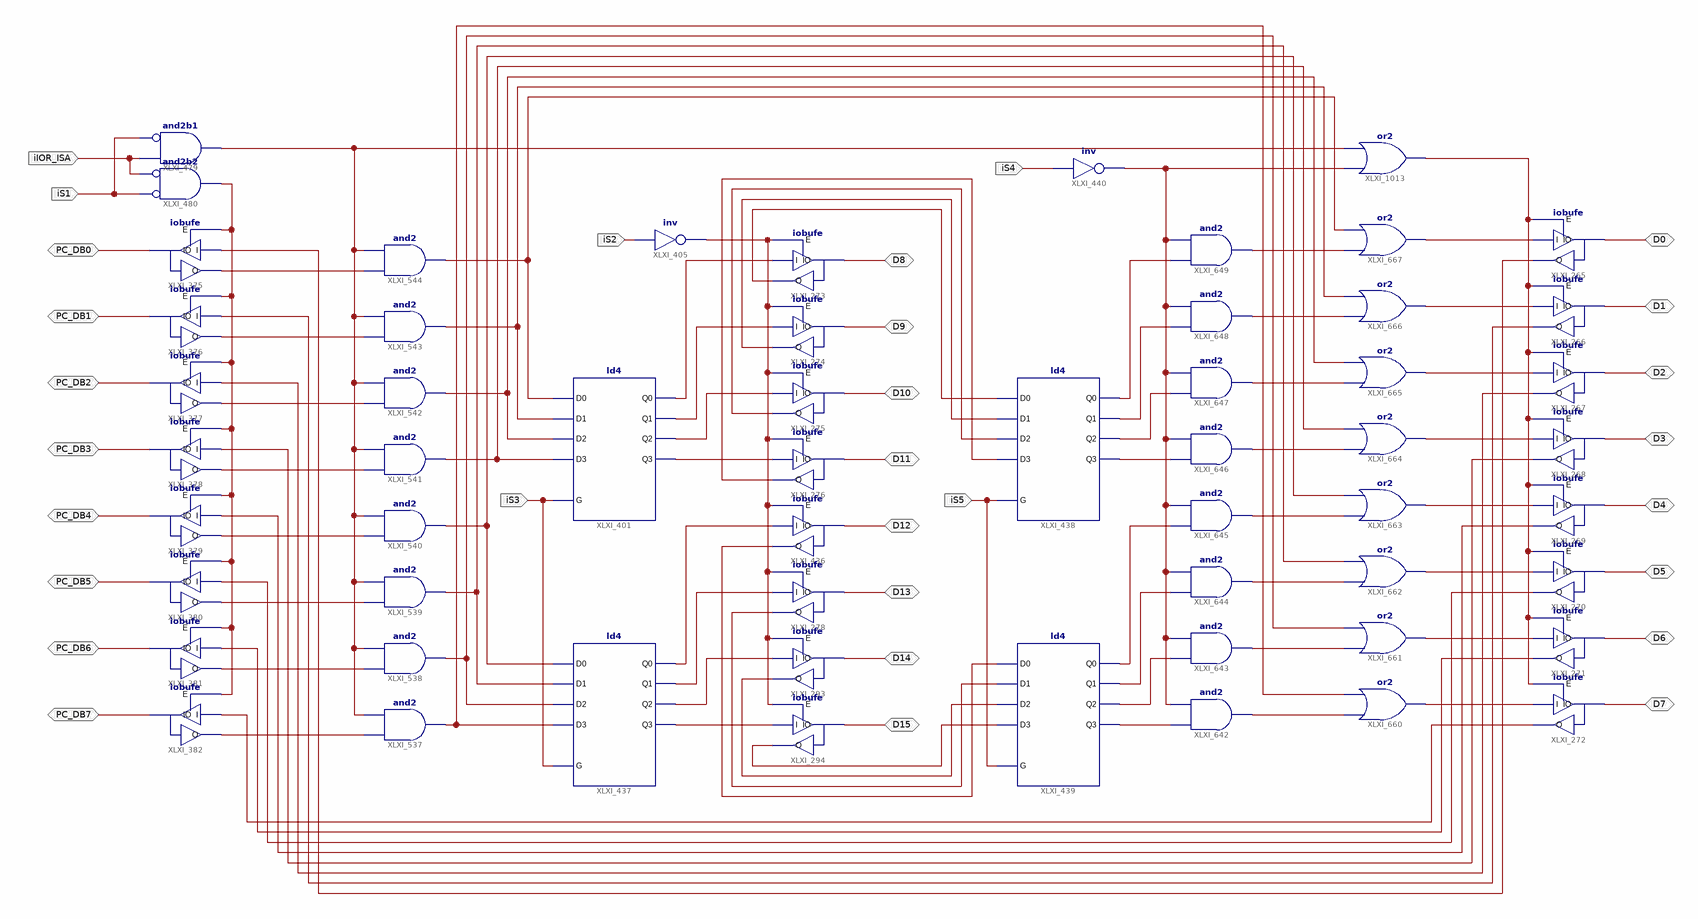
[diagram p0: schematic sheet 1]
// Xilinx ISE schematic IDE_MUX_8bit_16bit.sch (xc9500xl) as structural Verilog: 57 symbols, 30 ports
module IDE_MUX_8bit_16bit (
  input  iS3,
  input  iS2,
  input  iS4,
  input  iS5,
  input  iS1,
  input  iIOR_ISA,
  inout  D12,
  inout  D13,
  inout  D14,
  inout  D15,
  inout  D8,
  inout  D9,
  inout  D10,
  inout  D11,
  inout  PC_DB5,
  inout  PC_DB6,
  inout  PC_DB7,
  inout  PC_DB4,
  inout  PC_DB3,
  inout  PC_DB2,
  inout  PC_DB1,
  inout  PC_DB0,
  inout  D7,
  inout  D6,
  inout  D5,
  inout  D4,
  inout  D3,
  inout  D2,
  inout  D1,
  inout  D0
);

  wire XLXN_50, XLXN_130, XLXN_159, XLXN_160, XLXN_161, XLXN_168, XLXN_169, XLXN_177, XLXN_199, XLXN_200,
       XLXN_201, XLXN_211, XLXN_212, XLXN_213, XLXN_214, XLXN_285, XLXN_289, XLXN_290, XLXN_563, XLXN_564,
       XLXN_565, XLXN_576, XLXN_577, XLXN_578, XLXN_579, XLXN_584, XLXN_594, XLXN_727, XLXN_734, XLXN_738,
       XLXN_742, XLXN_743, XLXN_744, XLXN_745, XLXN_773, XLXN_774, XLXN_775, XLXN_776, XLXN_777, XLXN_778,
       XLXN_779, XLXN_780, XLXN_781, XLXN_782, XLXN_783, XLXN_784, XLXN_785, XLXN_786, XLXN_787, XLXN_1089,
       XLXN_1090, XLXN_1092, XLXN_1093, XLXN_1102, XLXN_1110, XLXN_1111, XLXN_1112, XLXN_1247, XLXN_1249,
       XLXN_1283, XLXN_1407, XLXN_1414, XLXN_1415, XLXN_1416, XLXN_1417, XLXN_1418, XLXN_1419, XLXN_1420,
       XLXN_1421;

  and XLXI_537 (XLXN_1247, XLXN_289, XLXN_1283);
  and XLXI_538 (XLXN_564, XLXN_563, XLXN_1283);
  and XLXI_539 (XLXN_565, XLXN_285, XLXN_1283);
  and XLXI_540 (XLXN_1093, XLXN_290, XLXN_1283);
  and XLXI_541 (XLXN_1092, XLXN_579, XLXN_1283);
  and XLXI_542 (XLXN_1090, XLXN_578, XLXN_1283);
  and XLXI_543 (XLXN_1089, XLXN_577, XLXN_1283);
  and XLXI_544 (XLXN_594, XLXN_576, XLXN_1283);
  ld4 XLXI_401 (
    .D0(XLXN_594), .D1(XLXN_1089), .D2(XLXN_1090), .D3(XLXN_1092), .G(iS3), .Q0(XLXN_159), .Q1(XLXN_160),
    .Q2(XLXN_161), .Q3(XLXN_50));
  ld4 XLXI_437 (
    .D0(XLXN_1093), .D1(XLXN_565), .D2(XLXN_564), .D3(XLXN_1247), .G(iS3), .Q0(XLXN_177), .Q1(XLXN_168),
    .Q2(XLXN_169), .Q3(XLXN_130));
  iobufe XLXI_278 (.I(XLXN_168), .IO(D13), .O(XLXN_201), .E(XLXN_734));
  iobufe XLXI_293 (.I(XLXN_169), .IO(D14), .O(XLXN_200), .E(XLXN_734));
  iobufe XLXI_294 (.I(XLXN_130), .IO(D15), .O(XLXN_199), .E(XLXN_734));
  iobufe XLXI_436 (.I(XLXN_177), .IO(D12), .O(XLXN_727), .E(XLXN_734));
  iobufe XLXI_273 (.I(XLXN_159), .IO(D8), .O(XLXN_214), .E(XLXN_734));
  iobufe XLXI_274 (.I(XLXN_160), .IO(D9), .O(XLXN_213), .E(XLXN_734));
  iobufe XLXI_275 (.I(XLXN_161), .IO(D10), .O(XLXN_212), .E(XLXN_734));
  iobufe XLXI_276 (.I(XLXN_50), .IO(D11), .O(XLXN_211), .E(XLXN_734));
  and XLXI_642 (XLXN_773, XLXN_738, XLXN_1102);
  and XLXI_643 (XLXN_776, XLXN_1110, XLXN_1102);
  and XLXI_644 (XLXN_777, XLXN_1111, XLXN_1102);
  and XLXI_645 (XLXN_782, XLXN_1112, XLXN_1102);
  and XLXI_646 (XLXN_781, XLXN_742, XLXN_1102);
  and XLXI_647 (XLXN_783, XLXN_743, XLXN_1102);
  and XLXI_648 (XLXN_785, XLXN_744, XLXN_1102);
  and XLXI_649 (XLXN_1249, XLXN_745, XLXN_1102);
  not XLXI_440 (XLXN_1102, iS4);
  not XLXI_405 (XLXN_734, iS2);
  ld4 XLXI_439 (
    .D0(XLXN_727), .D1(XLXN_201), .D2(XLXN_200), .D3(XLXN_199), .G(iS5), .Q0(XLXN_1112), .Q1(XLXN_1111),
    .Q2(XLXN_1110), .Q3(XLXN_738));
  ld4 XLXI_438 (
    .D0(XLXN_214), .D1(XLXN_213), .D2(XLXN_212), .D3(XLXN_211), .G(iS5), .Q0(XLXN_745), .Q1(XLXN_744),
    .Q2(XLXN_743), .Q3(XLXN_742));
  or XLXI_667 (XLXN_787, XLXN_1249, XLXN_594);
  or XLXI_666 (XLXN_786, XLXN_785, XLXN_1089);
  or XLXI_665 (XLXN_784, XLXN_783, XLXN_1090);
  or XLXI_664 (XLXN_780, XLXN_781, XLXN_1092);
  or XLXI_663 (XLXN_779, XLXN_782, XLXN_1093);
  or XLXI_662 (XLXN_778, XLXN_777, XLXN_565);
  or XLXI_661 (XLXN_775, XLXN_776, XLXN_564);
  or XLXI_660 (XLXN_774, XLXN_773, XLXN_1247);
  iobufe XLXI_375 (.I(XLXN_1421), .IO(PC_DB0), .O(XLXN_576), .E(XLXN_584));
  iobufe XLXI_376 (.I(XLXN_1420), .IO(PC_DB1), .O(XLXN_577), .E(XLXN_584));
  iobufe XLXI_377 (.I(XLXN_1419), .IO(PC_DB2), .O(XLXN_578), .E(XLXN_584));
  iobufe XLXI_378 (.I(XLXN_1418), .IO(PC_DB3), .O(XLXN_579), .E(XLXN_584));
  iobufe XLXI_379 (.I(XLXN_1417), .IO(PC_DB4), .O(XLXN_290), .E(XLXN_584));
  iobufe XLXI_380 (.I(XLXN_1416), .IO(PC_DB5), .O(XLXN_285), .E(XLXN_584));
  iobufe XLXI_381 (.I(XLXN_1415), .IO(PC_DB6), .O(XLXN_563), .E(XLXN_584));
  iobufe XLXI_382 (.I(XLXN_1414), .IO(PC_DB7), .O(XLXN_289), .E(XLXN_584));
  and XLXI_480 (XLXN_584, ~iS1, ~iIOR_ISA);  // and2b2
  and XLXI_479 (XLXN_1283, ~iS1, iIOR_ISA);  // and2b1
  iobufe XLXI_265 (.I(XLXN_787), .IO(D0), .O(XLXN_1421), .E(XLXN_1407));
  iobufe XLXI_272 (.I(XLXN_774), .IO(D7), .O(XLXN_1414), .E(XLXN_1407));
  iobufe XLXI_271 (.I(XLXN_775), .IO(D6), .O(XLXN_1415), .E(XLXN_1407));
  iobufe XLXI_270 (.I(XLXN_778), .IO(D5), .O(XLXN_1416), .E(XLXN_1407));
  iobufe XLXI_269 (.I(XLXN_779), .IO(D4), .O(XLXN_1417), .E(XLXN_1407));
  iobufe XLXI_268 (.I(XLXN_780), .IO(D3), .O(XLXN_1418), .E(XLXN_1407));
  iobufe XLXI_267 (.I(XLXN_784), .IO(D2), .O(XLXN_1419), .E(XLXN_1407));
  iobufe XLXI_266 (.I(XLXN_786), .IO(D1), .O(XLXN_1420), .E(XLXN_1407));
  or XLXI_1013 (XLXN_1407, XLXN_1102, XLXN_1283);
endmodule
